# Altium schematic sheet USB HUB.SchDoc
size A3; SheetNumber: 7; SheetTotal: 11
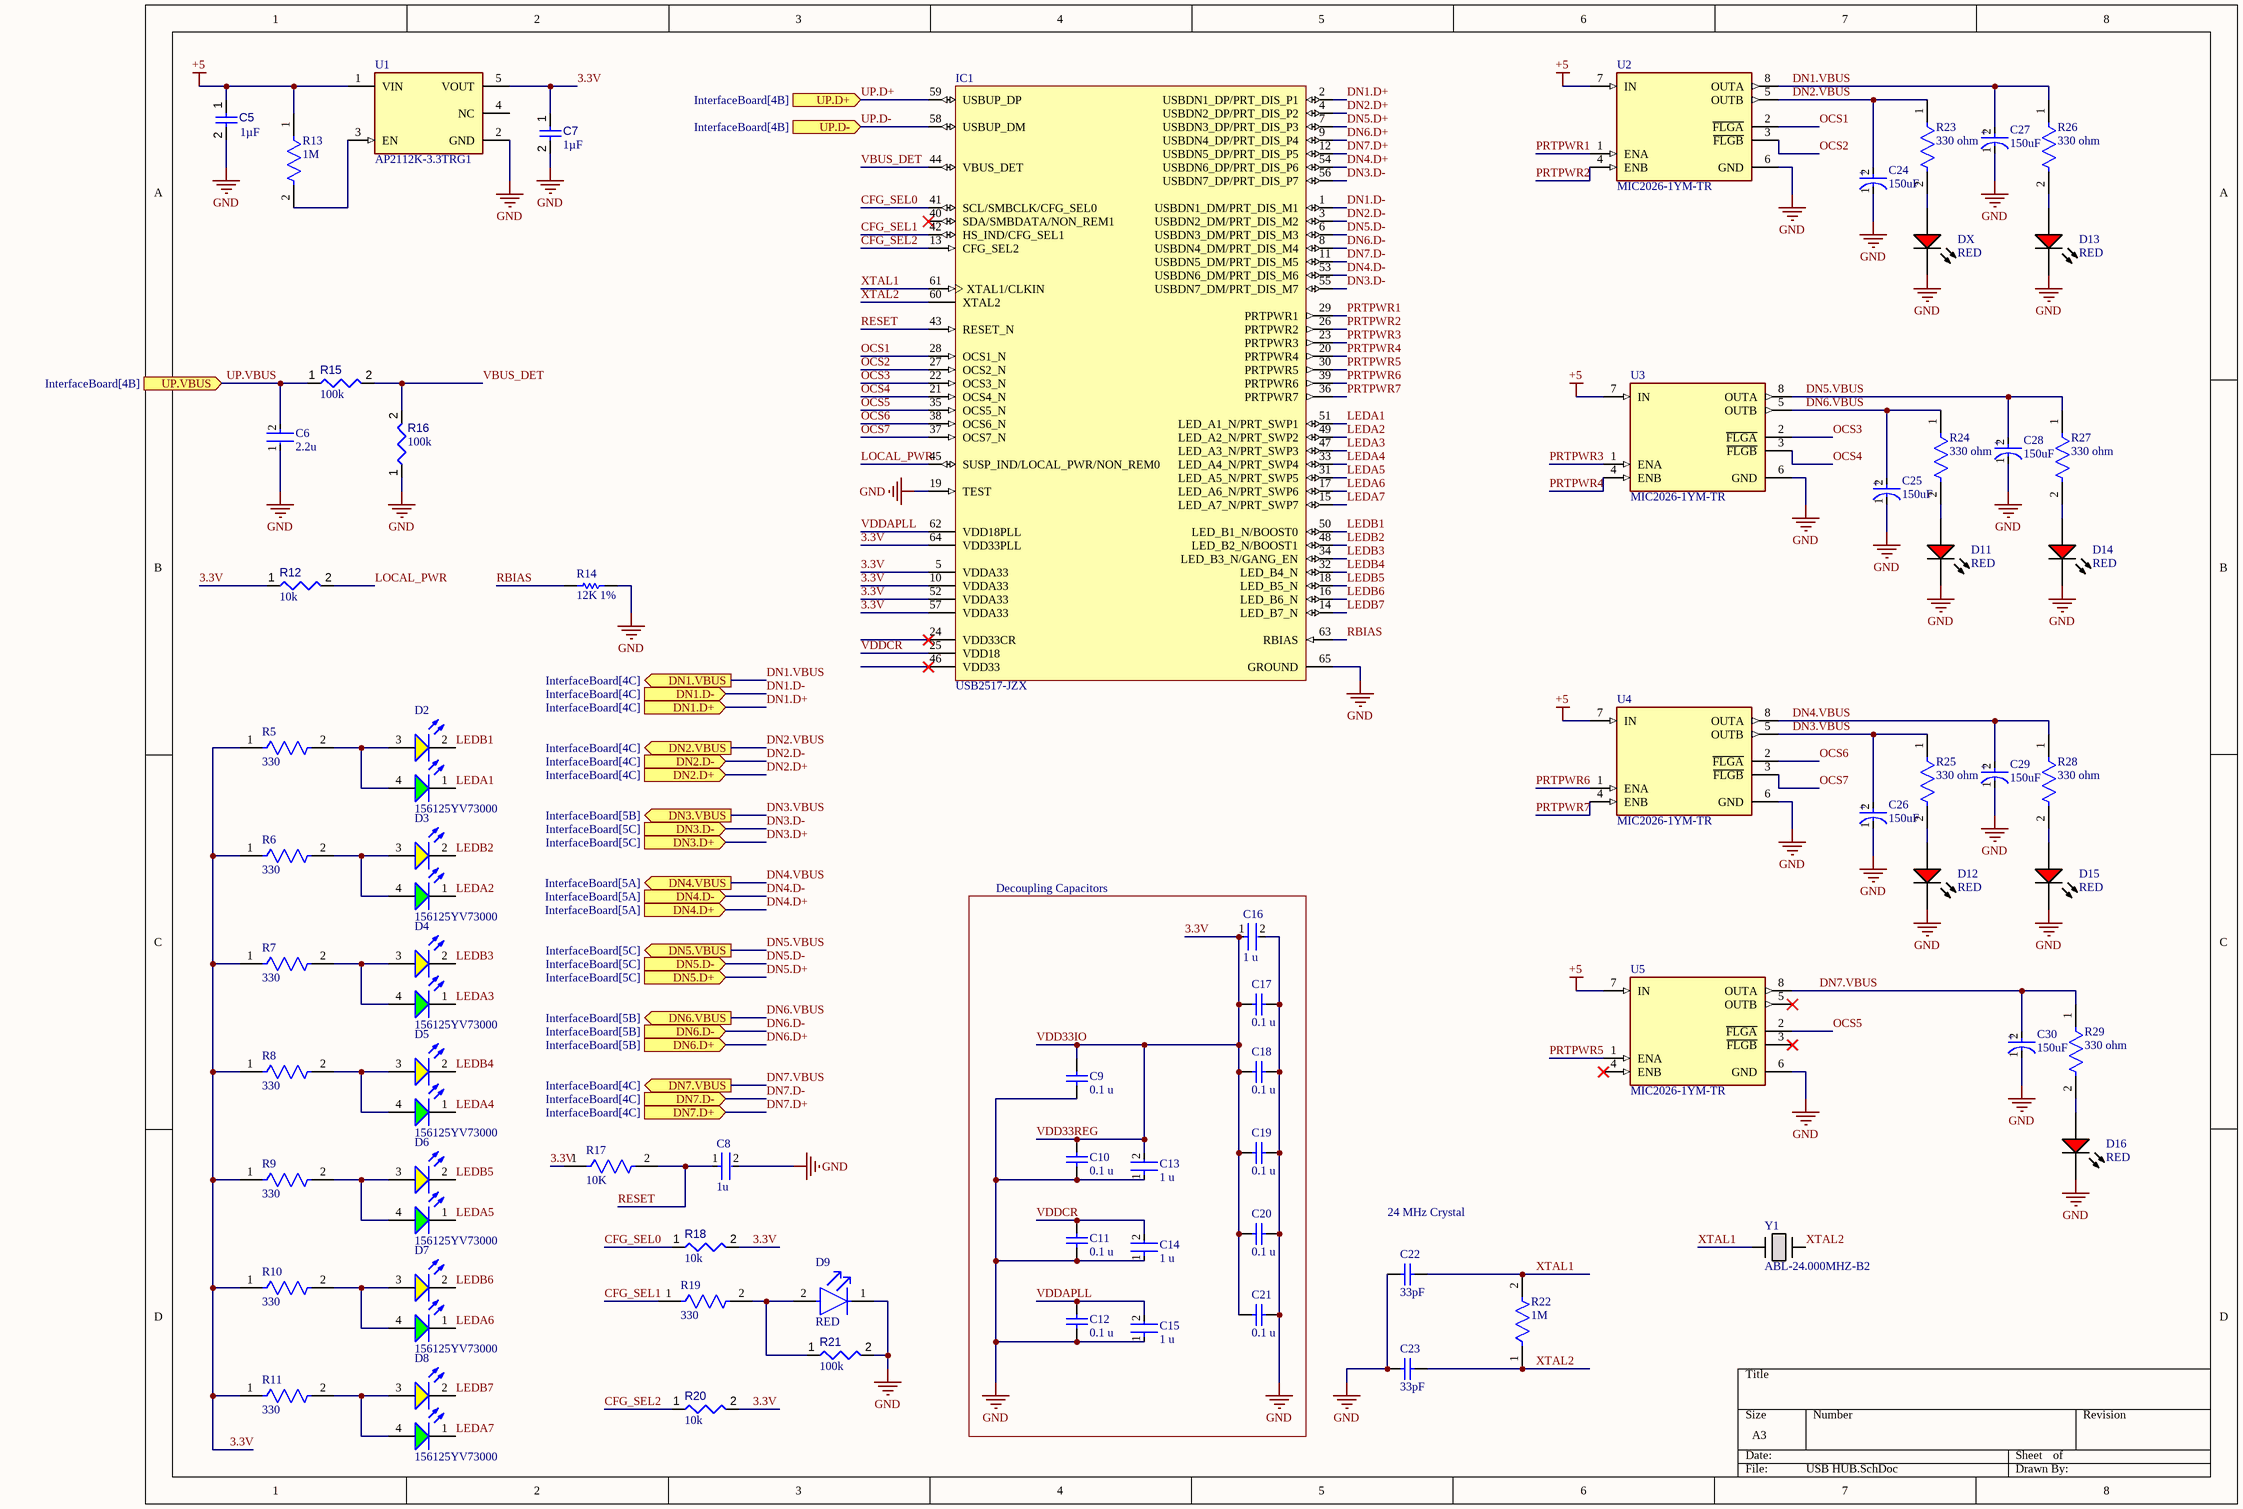
[diagram p0: USB HUB.SchDoc]

## Parts
C5  value 1µF  [CAPC1608X94X35NL15T15]  (hidden comment: Capacitor 1 uF +/- 10% 16 V 0603)
C6  2.2u  [FP-C1608-080-0_1-MFG]
C7  value 1µF  [CAPC1608X94X35NL15T15]  (hidden comment: Capacitor 1 uF +/- 10% 16 V 0603)
C8  1u  [FP-0603-L_1_6_0_15-W_0_81-IPC_A]
C9  0.1 u  [CAPC1608X90X35LL15T15]
C10  0.1 u  [CAPC1608X90X35LL15T15]
C11  0.1 u  [CAPC1608X90X35LL15T15]
C12  0.1 u  [CAPC1608X90X35LL15T15]
C13  1 u  [FP-0603-L_1_6_0_15-W_0_8-IPC_C]
C14  1 u  [FP-0603-L_1_6_0_15-W_0_8-IPC_C]
C15  1 u  [FP-0603-L_1_6_0_15-W_0_8-IPC_C]
C16  1 u  [FP-0603-L_1_6_0_15-W_0_8-IPC_C]
C17  0.1 u  [CAPC1608X90X35LL15T15]
C18  0.1 u  [CAPC1608X90X35LL15T15]
C19  0.1 u  [CAPC1608X90X35LL15T15]
C20  0.1 u  [CAPC1608X90X35LL15T15]
C21  0.1 u  [CAPC1608X90X35LL15T15]
C22  33pF  [WCAP-CSGP_0603_L1.6W0.8H0.8_Reflow]
C23  33pF  [WCAP-CSGP_0603_L1.6W0.8H0.8_Reflow]
C24  150uF  [FP-OS-CON-SMT-B6-MFG]
C25  150uF  [FP-OS-CON-SMT-B6-MFG]
C26  150uF  [FP-OS-CON-SMT-B6-MFG]
C27  150uF  [FP-OS-CON-SMT-B6-MFG]
C28  150uF  [FP-OS-CON-SMT-B6-MFG]
C29  150uF  [FP-OS-CON-SMT-B6-MFG]
C30  150uF  [FP-OS-CON-SMT-B6-MFG]
D2  156125YV73000  [WL-SBRW_1205_reverse mount]
D3  156125YV73000  [WL-SBRW_1205_reverse mount]
D4  156125YV73000  [WL-SBRW_1205_reverse mount]
D5  156125YV73000  [WL-SBRW_1205_reverse mount]
D6  156125YV73000  [WL-SBRW_1205_reverse mount]
D7  156125YV73000  [WL-SBRW_1205_reverse mount]
D8  156125YV73000  [WL-SBRW_1205_reverse mount]
D9  RED  [FP-SML-LX0603SIW-TR-MFG]
D11  RED  [LTST-C191KRKT_V]
D12  RED  [LTST-C191KRKT_V]
D13  RED  [LTST-C191KRKT_V]
D14  RED  [LTST-C191KRKT_V]
D15  RED  [LTST-C191KRKT_V]
D16  RED  [LTST-C191KRKT_V]
DX  RED  [LTST-C191KRKT_V]
IC1  USB2517-JZX  [MCHP-QFN-64-4700X4700TP_L]
R5  330  [FP-CRGCQ0603-IPC_C]
R6  330  [FP-CRGCQ0603-IPC_C]
R7  330  [FP-CRGCQ0603-IPC_C]
R8  330  [FP-CRGCQ0603-IPC_C]
R9  330  [FP-CRGCQ0603-IPC_C]
R10  330  [FP-CRGCQ0603-IPC_C]
R11  330  [FP-CRGCQ0603-IPC_C]
R12  value 10k  [RESC1608X55X25ML10T15]  (hidden comment: Resistor 10k +/-1% 0603 100 mW)
R13  1M  [FP-AC0603-IPC_A]
R14  12K 1%  [RESC1608X55X25LL10T15]
R15  value 100k  [RESC1608X55X25ML10T15]  (hidden comment: Resistor 100k +/-1% 0603 100 mW)
R16  value 100k  [RESC1608X55X25ML10T15]  (hidden comment: Resistor 100k +/-1% 0603 100 mW)
R17  10K  [FP-CRGCQ0603-IPC_C]
R18  value 10k  [RESC1608X55X25ML10T15]  (hidden comment: Resistor 10k +/-1% 0603 100 mW)
R19  330  [FP-CRGCQ0603-IPC_C]
R20  value 10k  [RESC1608X55X25ML10T15]  (hidden comment: Resistor 10k +/-1% 0603 100 mW)
R21  100k  [RESC1608X55X25ML10T15]
R22  1M  [FP-CRGP0603-IPC_C]
R23  330 ohm  [FP-MCT0603-MFG]
R24  330 ohm  [FP-MCT0603-MFG]
R25  330 ohm  [FP-MCT0603-MFG]
R26  330 ohm  [FP-MCT0603-MFG]
R27  330 ohm  [FP-MCT0603-MFG]
R28  330 ohm  [FP-MCT0603-MFG]
R29  330 ohm  [FP-MCT0603-MFG]
U1  AP2112K-3.3TRG1  [FP-SOT25-IPC_A]
U2  MIC2026-1YM-TR  [FP-SOICN-8LD-PL-1-IPC_B]
U3  MIC2026-1YM-TR  [FP-SOICN-8LD-PL-1-IPC_B]
U4  MIC2026-1YM-TR  [FP-SOICN-8LD-PL-1-IPC_B]
U5  MIC2026-1YM-TR  [FP-SOICN-8LD-PL-1-IPC_B]
Y1  ABL-24.000MHZ-B2  [XTAL_HC49P488W46L1150T500H350]

## Blocks framed on the sheet
Decoupling Capacitors: C9-C21

## Ports
DN1.D+ (in, see InterfaceBoard[4C]), DN1.D- (in, see InterfaceBoard[4C]), DN1.VBUS (out, see InterfaceBoard[4C]), DN2.D+ (in, see InterfaceBoard[4C]), DN2.D- (in, see InterfaceBoard[4C]), DN2.VBUS (out, see InterfaceBoard[4C]), DN3.D+ (in, see InterfaceBoard[5C]), DN3.D- (in, see InterfaceBoard[5C]), DN3.VBUS (out, see InterfaceBoard[5B]), DN4.D+ (in, see InterfaceBoard[5A]), DN4.D- (in, see InterfaceBoard[5A]), DN4.VBUS (out, see InterfaceBoard[5A]), DN5.D+ (in, see InterfaceBoard[5C]), DN5.D- (in, see InterfaceBoard[5C]), DN5.VBUS (out, see InterfaceBoard[5C]), DN6.D+ (in, see InterfaceBoard[5B]), DN6.D- (in, see InterfaceBoard[5B]), DN6.VBUS (out, see InterfaceBoard[5B]), DN7.D+ (in, see InterfaceBoard[4C]), DN7.D- (in, see InterfaceBoard[4C]), DN7.VBUS (out, see InterfaceBoard[4C]), UP.D+ (in, see InterfaceBoard[4B]), UP.D- (in, see InterfaceBoard[4B]), UP.VBUS (in, see InterfaceBoard[4B])

## Nets
+5: C5.1 R13.1 U1.1(VIN) U2.7(IN) U3.7(IN) U4.7(IN) U5.7(IN)
GND: C5.2 C6.1 C7.2 C8.2 C9.2 C10.2 C11.2 C12.2 C13.1 C14.1 C15.1 C16.2 C17.1 C18.1 C19.1 C20.1 C21.1 C22.1 C23.1 C24.1(C) C25.1(C) C26.1(C) C27.1(C) C28.1(C) C29.1(C) C30.1(C) D9.1(C) D11.2(K) D12.2(K) D13.2(K) D14.2(K) D15.2(K) D16.2(K) DX.2(K) IC1.19(TEST) IC1.65(GROUND) R14.2 R16.1 R21.2 U1.2(GND) U2.6(GND) U3.6(GND) U4.6(GND) U5.6(GND)
3.3V: C7.1 C9.1 C10.1 C13.2 C16.1 C17.2 C18.2 C19.2 C20.2 C21.2 IC1.5(VDDA33) IC1.10(VDDA33) IC1.52(VDDA33) IC1.57(VDDA33) IC1.64(VDD33PLL) R5.1 R6.1 R7.1 R8.1 R9.1 R10.1 R11.1 R12.1 R17.1 R18.2 R20.2 U1.5(VOUT)  [also labelled VDD33IO, VDD33REG]
CFG_SEL0: IC1.41(SCL/SMBCLK/CFG_SEL0) R18.1
CFG_SEL1: IC1.42(HS_IND/CFG_SEL1) R19.1
CFG_SEL2: IC1.13(CFG_SEL2) R20.1
DN1.D+: IC1.2(USBDN1_DP/PRT_DIS_P1) ; port DN1.D+
DN1.D-: IC1.1(USBDN1_DM/PRT_DIS_M1) ; port DN1.D-
DN1.VBUS: C27.2(A) R26.1 U2.8(OUTA) ; port DN1.VBUS
DN2.D+: IC1.4(USBDN2_DP/PRT_DIS_P2) ; port DN2.D+
DN2.D-: IC1.3(USBDN2_DM/PRT_DIS_M2) ; port DN2.D-
DN2.VBUS: C24.2(A) R23.1 U2.5(OUTB) ; port DN2.VBUS
DN3.D+: port DN3.D+
DN3.D-: IC1.55(USBDN7_DM/PRT_DIS_M7) IC1.56(USBDN7_DP/PRT_DIS_P7) ; port DN3.D-
DN3.VBUS: C26.2(A) R25.1 U4.5(OUTB) ; port DN3.VBUS
DN4.D+: IC1.54(USBDN6_DP/PRT_DIS_P6) ; port DN4.D+
DN4.D-: IC1.53(USBDN6_DM/PRT_DIS_M6) ; port DN4.D-
DN4.VBUS: C29.2(A) R28.1 U4.8(OUTA) ; port DN4.VBUS
DN5.D+: IC1.7(USBDN3_DP/PRT_DIS_P3) ; port DN5.D+
DN5.D-: IC1.6(USBDN3_DM/PRT_DIS_M3) ; port DN5.D-
DN5.VBUS: C28.2(A) R27.1 U3.8(OUTA) ; port DN5.VBUS
DN6.D+: IC1.9(USBDN4_DP/PRT_DIS_P4) ; port DN6.D+
DN6.D-: IC1.8(USBDN4_DM/PRT_DIS_M4) ; port DN6.D-
DN6.VBUS: C25.2(A) R24.1 U3.5(OUTB) ; port DN6.VBUS
DN7.D+: IC1.12(USBDN5_DP/PRT_DIS_P5) ; port DN7.D+
DN7.D-: IC1.11(USBDN5_DM/PRT_DIS_M5) ; port DN7.D-
DN7.VBUS: C30.2(A) R29.1 U5.8(OUTA) ; port DN7.VBUS
LEDA1: D2.1(K) IC1.51(LED_A1_N/PRT_SWP1)
LEDA2: D3.1(K) IC1.49(LED_A2_N/PRT_SWP2)
LEDA3: D4.1(K) IC1.47(LED_A3_N/PRT_SWP3)
LEDA4: D5.1(K) IC1.33(LED_A4_N/PRT_SWP4)
LEDA5: D6.1(K) IC1.31(LED_A5_N/PRT_SWP5)
LEDA6: D7.1(K) IC1.17(LED_A6_N/PRT_SWP6)
LEDA7: D8.1(K) IC1.15(LED_A7_N/PRT_SWP7)
LEDB1: D2.2(K) IC1.50(LED_B1_N/BOOST0)
LEDB2: D3.2(K) IC1.48(LED_B2_N/BOOST1)
LEDB3: D4.2(K) IC1.34(LED_B3_N/GANG_EN)
LEDB4: D5.2(K) IC1.32(LED_B4_N)
LEDB5: D6.2(K) IC1.18(LED_B5_N)
LEDB6: D7.2(K) IC1.16(LED_B6_N)
LEDB7: D8.2(K) IC1.14(LED_B7_N)
LOCAL_PWR: IC1.45(SUSP_IND/LOCAL_PWR/NON_REM0) R12.2
OCS1: IC1.28(OCS1_N) U2.2(~{FLGA})
OCS2: IC1.27(OCS2_N) U2.3(~{FLGB})
OCS3: IC1.22(OCS3_N) U3.2(~{FLGA})
OCS4: IC1.21(OCS4_N) U3.3(~{FLGB})
OCS5: IC1.35(OCS5_N) U5.2(~{FLGA})
OCS6: IC1.38(OCS6_N) U4.2(~{FLGA})
OCS7: IC1.37(OCS7_N) U4.3(~{FLGB})
PRTPWR1: IC1.29(PRTPWR1) U2.1(ENA)
PRTPWR2: IC1.26(PRTPWR2) U2.4(ENB)
PRTPWR3: IC1.23(PRTPWR3) U3.1(ENA)
PRTPWR4: IC1.20(PRTPWR4) U3.4(ENB)
PRTPWR5: IC1.30(PRTPWR5) U5.1(ENA)
PRTPWR6: IC1.39(PRTPWR6) U4.1(ENA)
PRTPWR7: IC1.36(PRTPWR7) U4.4(ENB)
RBIAS: IC1.63(RBIAS) R14.1
RESET: C8.1 IC1.43(RESET_N) R17.2
UP.D+: IC1.59(USBUP_DP) ; port UP.D+
UP.D-: IC1.58(USBUP_DM) ; port UP.D-
UP.VBUS: C6.2 R15.1 ; port UP.VBUS
VBUS_DET: IC1.44(VBUS_DET) R15.2 R16.2
VDDAPLL: C12.1 C15.2 IC1.62(VDD18PLL)
VDDCR: C11.1 C14.2 IC1.25(VDD18)
XTAL1: C22.2 IC1.61(XTAL1/CLKIN) R22.2 Y1.1
XTAL2: C23.2 IC1.60(XTAL2) R22.1 Y1.2
NetD2_3: D2.3(A) D2.4(A) R5.2
NetD3_3: D3.3(A) D3.4(A) R6.2
NetD4_3: D4.3(A) D4.4(A) R7.2
NetD5_3: D5.3(A) D5.4(A) R8.2
NetD6_3: D6.3(A) D6.4(A) R9.2
NetD7_3: D7.3(A) D7.4(A) R10.2
NetD8_3: D8.3(A) D8.4(A) R11.2
NetD9_2: D9.2(A) R19.2 R21.1
NetD11_1: D11.1(A) R24.2
NetD12_1: D12.1(A) R25.2
NetD13_1: D13.1(A) R26.2
NetD14_1: D14.1(A) R27.2
NetD15_1: D15.1(A) R28.2
NetD16_1: D16.1(A) R29.2
NetDX_1: DX.1(A) R23.2
NetR13_2: R13.2 U1.3(EN)

Not connected (* = marked no-connect by the designer): IC1 24(VDD33CR)* 40(SDA/SMBDATA/NON_REM1)* 46(VDD33)*; U1 4(NC); U5 3(~{FLGB})* 4(ENB)* 5(OUTB)*

## Notes on the sheet
- 24 MHz Crystal
- (in symbol CMP-05428-000017-2) +

## Library data of the parts
C5 C7 = CMP-001-00003-6: Chip Capacitor, 1 uF, +/- 10%, 16 V, 0603 (1608 Metric); Voltage Rating: 16V; Capacitor Type: Ceramic; Max Operating Temperature: 125°C; Pins: 2; Tolerance: 10%; Min Operating Temperature: -55°C; RoHS Compliant: True; Mounting Technology: SM; Case/Package: 0603
C6 = CMP-08246-003049-1: Multilayer Ceramic Capacitors 2.2μF ±10% 25V X5R SMD 0603; Capacitance: 2.2uF; Termination: SMD/SMT; Dielectric Material: Ceramic; REACH SVHC: No SVHC; Voltage Rating (DC): 25V; Voltage Rating: 25V; RoHS Compliant: Yes; Case Code (Imperial): 0603; Case/Package: 0603; Height: 0.8mm; Mount: Surface Mount; Min Operating Temperature: -55°C; Tolerance: 10%; Radiation Hardening: No; Dielectric: X5R; Depth: 0.8mm; Package Quantity: 4000; Length: 1.6mm; Weight: 7.1E-05oz; Resistor Type: Ceramic; Series: C; Thickness: 0.035inch; Width: 0.031inch; Case Code (Metric): 1608; Lead Free: Lead Free; Max Operating Temperature: 85°C; Packaging: Tape and Reel
C8 = CMP-2006-04474-2: General Purpose Ceramic Capacitor, 0603, 1uF, 10%, X5R, 15%, 6.3V; Insulation Resistance: 100GR; Dissipation Factor: 5%; Package Quantity: 1; Mount: Surface Mount; Series: -; Number of Pins: 2; Length: 1.6mm; RoHS Compliant: Yes; Capacitance: 1uF; Depth: 0.81mm; Case Code (Imperial): 0603; Lead Free: Lead Free; Max Operating Temperature: 85°C; Case Code (Metric): 1608; Min Operating Temperature: -55°C; Contact Plating: Tin; Voltage: 6.3V; Tolerance: 10%; Width: 0.032inch; Voltage Rating (DC): 6.3V; Voltage Rating: 6.3V; Termination: SMD/SMT; Radiation Hardening: No; Case/Package: 0603; Thickness: 0.035inch; Height: 0.9mm; REACH SVHC: No SVHC; Packaging: Tape and Reel; Construction: Flat; Dielectric: X5R
C9-C12 C17-C21 = CMP-2006-04390-1: 06035C104KAT4A; Manufacturer: AVX Interconnect / Elco; Part Number: 06035C104KAT4A
C13-C16 = CMP-2000-07531-4: Ceramic Capacitor General Use 1uF ±10% 50V X7R 0603 / UMK107AB7105KA-T; Series: M; Width: 0.031inch; Mount: Surface Mount; Radiation Hardening: No; Voltage Rating (DC): 50V; Packaging: Tape and Reel; Termination: SMD/SMT; Depth: 0.8mm; Case Code (Metric): 1608; Case Code (Imperial): 0603; Height: 0.8mm; Voltage Rating: 50V; Package Quantity: 1; Halogen Free: Halogen Free; Dielectric: X7R; Min Operating Temperature: -55°C; Length: 1.6mm; Construction: Flat; Tolerance: 10%; Thickness: 0.037inch; Max Operating Temperature: 125°C; Case/Package: 0603; Capacitance: 1uF; RoHS Compliant: Yes
C22 C23 = CMP-03913-65419545-2: Ceramic Capacitor 33pF, 16VDC, 0603, ±5 %; Voltage Rating: 16V; Tolerance: 5%; Insulation Resistance: 10GΩ; Thickness: 863.6µm; Height: 800µm; Width: 800µm; Case Code (Imperial): 0603; Case Code (Metric): 1608; Case/Package: 0603; Mount: Surface Mount; Min Operating Temperature: -55°C; RoHS: Compliant; Packaging: Cut Tape; Capacitance: 33pF; Max Operating Temperature: 125°C; Length: 1.6mm; Voltage Rating (DC): 16V
C24-C30 = CMP-05428-000017-2: Conductive Polymer Aluminum Solid Capacitors (OS-CON) 150uF ±20% 6.3V; Ripple Current: 3.52A; Leakage Current: 500uA; ESR (Equivalent Series Resistance): 12mR; Polarity: Polar; Dissipation Factor: 12%; Life (Hours): 2000Hour; Number of Pins: 6; Voltage Rating (DC): 6.3V; Lead Free: Lead Free; Height: 5.9mm; Case/Package: Radial; Package Quantity: 1500; Length: 5.9mm; Tolerance: 20%; Voltage: 6.3V; REACH SVHC: No SVHC; Mount: Surface Mount; Min Operating Temperature: -55°C; Ripple Current (AC): 3.52A; Packaging: Tape and Reel; Series: OS-CON™, SVPE; Max Operating Temperature: 105°C; Diameter: 5mm; Voltage Rating: 6.3V; Capacitance: 150uF; RoHS Compliant: Yes; Termination: SMD/SMT; Height - Seated (Max): 0.236inch
D2-D8 = CMP-03913-90235601-1: 156125YV73000 Dual Color LED, Yellow/bright Green, Water Clear, 1.2mm; Forward Voltage: 2V; Luminous Intensity: 50mcd; Viewing Angle: 120°; Forward Current: 40mA; Max Reverse Voltage (DC): 5V; Peak Wavelength: 573nm; Dominant Wavelength: 571nm; NexarPartId: 90235601; Length: 3.2mm; Packaging: Tape and Reel; RoHS: Compliant; Width: 1.2mm; Min Operating Temperature: -40°C; Max Operating Temperature: 85°C; Height: 800µm
D9 = CMP-57192-000009-1: LED RED DIFFUSED SMD; Test Current: 20mA; Forward Voltage: 2V; Approvals: UL; Dominant Wavelength: 636nm; Viewing Angle: 140°; Lens Color: White; Luminous Intensity: 60mcd; Power Rating: 50mW; Number of LEDs: 1; Color: Red; Forward Current: 20mA; Moisture Sensitivity Level: 2; Case Code (Imperial): 0603; Lead Free: Lead Free; Lens Transparency: Diffused; Case Code (Metric): 1608; Height: 0.6mm; Max Operating Temperature: 85°C; Width: 0.8mm; Lens Style: Diffused; Illumination Color: Red; Wavelength: 636nm; REACH SVHC: No SVHC; Package Quantity: 1; RoHS Compliant: Yes; Case/Package: 0603; Number of Pins: 2; Packaging: Tape and Reel; Length: 1.6mm; Mount: Surface Mount; Min Operating Temperature: -25°C
D11-D16 DX = CMP-007-00024-2: LED Uni-Color Red, 62.5 mW, 25 mA, -30 to 85 degC, 2-Pin SMD, RoHS, Tape and Reel; Manufacturer: Lite-On; Power: 75mW; Forward Voltage: 2V; Luminous Intensity: 54mcd; Lens Style: Diffused; Viewing Angle: 130degrees; Forward Current: 20mA; Manufacturer URL: http://www.us.liteon.com/; Case/Package: 0603; Datasheet Version: Rev. F, 05/2013; Package Reference: C191KRKT; Datasheet URL: http://optoelectronics.liteon.com/upload/download/DS-22-99-0151/S_110_LTST-C190KRKT.pdf; Package Description: 2-Pin Surface Mount Device, Body 1.6 x 0.8 mm; Nominal Vf: 2V; Packaging: TapeandReel; RoHS Compliant: True; Pins: 2; Illumination Colour: Red; Colour: Red; Mounting Technology: SM; Package Quantity: 3000; Min Operating Temperature: -55°C; Max Operating Temperature: 85°C
IC1 = CMP-0186-00330-1: USB 2.0 Hi-Speed 7-Port Hub Controller, 3 to 3.6 V, 0 to 70 degC, 64-Pin QFN, RoHS, Tape and Reel; Manufacturer: Microchip; USB Speed: High Speed; MultiTRAK Tech: TRUE; Packing: TRAY; MGMT I/F: I2C; Op Voltage: 3.3 V; Upstream Port: USB 2.0; Voltage Regulator: 1.8 V; Downstream Ports: 7; ComponentLink1URL: http://www.microchip.com/; Mounting Technology: Surface Mount; ROHS: TRUE; ComponentLink3URL: http://ww1.microchip.com/downloads/en/DeviceDoc/2517.pdf; DatasheetVersion: Rev. 2.8; ComponentLink2URL: http://ww1.microchip.com/downloads/en/DeviceDoc/2517.pdf; PackageReference: QFN-64; Operating Temperature: 0 to 70 degC; PackageDescription: 64-Pin Plastic Quad Flat No Lead Package, Body 9 x 9 mm, Pitch 0.5 mm; PartNumber: USB2517-JZX; ComponentLink2Description: Datasheet; ComponentLink3Description: Package Specification; ComponentLink1Description: Manufacturer URL
R5-R11 R19 = CMP-03211-002147-1: CRGCQ 0603 330R 5%; Manufacturer: TE Connectivity; Manufacturer Part Number: CRGCQ0603J330R; Temperature Coefficient: ±100ppm/°C; Power Rating: 0.1W; Value: 330Ω; Voltage Rating: 75V; Tolerance: 0.05; Device Class L1: Passive Components; ComponentLink2URL: https://www.te.com/commerce/DocumentDelivery/DDEController?Action=showdoc&DocId=Data+Sheet%7F1773204-3%7F1%7Fpdf%7FEnglish%7FENG_DS_1773204-3_1.pdf%7F4-2176339-581; ComponentLink2Description: Datasheet; RoHS: TRUE; Category: Res; Digikey Description: CRGCQ 0603 330R 5%; Lead Free: Yes; Octopart: https://octopart.com/crgcq0603j330r-te+connectivity-91018118; Mouser Description: Res General Purpose Thick Film 0603 330 Ohm 5% 1/10W ±100ppm/°C Molded Paper T/R; Height: 0.55mm; Composition: Thick Film; Series: CRGCQ; Package: CRGCQ0603; Device Class L3: Chip SMD Resistors; Resistance: 330Ω; Ambient Temperature Range High: +70°C; Temperature: -55°C to +155°C; Device Class L2: Resistors; Ipc Land Pattern Name: RESC16080X45; Temperature Range High: +155°C; Temperature Range Low: -55°C
R12 R18 R20 = CMP-009-00017-5: Chip Resistor, 10 KOhm, +/- 1%, 01 W, -55 to 155 degC, 0603 (1608 Metric); Voltage Rating: 50V; Power: 100mW; RoHS Compliant: True; Min Operating Temperature: -55°C; Pins: 2; Case/Package: 0603; Mounting Technology: SM; Max Operating Temperature: 155°C; Tolerance: 1%
R13 = CMP-03412-038630-1: RES 1MΩ 1.00% 0.1W 0603; Resistance: 1MR; Tolerance: 1%; Case/Package: 0603; RoHS Compliant: Yes
R14 = CMP-2000-04198-1: Manufacturer: Yageo; Part Number: RC0603FR-1312KL
R15 R16 R21 = CMP-009-00023-5: Chip Resistor, 100 KOhm, +/- 1%, 0.1 W, -55 to 155 degC, 0603 (1608 Metric); Voltage Rating: 50V; Power: 100mW; Max Operating Temperature: 155°C; RoHS Compliant: True; Tolerance: 1%; Pins: 2; Case/Package: 0603; Mounting Technology: SM; Min Operating Temperature: -55°C
  R21: Value: 100k
R17 = CMP-03211-009884-1: CRGCQ 0603 10K 5%; Manufacturer Part Number: CRGCQ0603J10K; Manufacturer: TE Connectivity; Tolerance: 0.05; Power Rating: 0.1W; Resistance: 10KΩ; Voltage Rating: 75V; Value: 10KΩ; Temperature Coefficient: ±100ppm/°C; Composition: Thick Film; ComponentLink2URL: https://www.te.com/commerce/DocumentDelivery/DDEController?Action=showdoc&DocId=Data+Sheet%7F1773204-3%7F1%7Fpdf%7FEnglish%7FENG_DS_1773204-3_1.pdf%7F4-2176339-923; Device Class L1: Passive Components; Package: CRGCQ0603; Mouser Description: Res Thick Film 0603 10K Ohm 5% 0.1W(1/10W) ±100ppm/C Pad SMD Automotive T/R; Temperature Range High: +155°C; Category: Res; Device Class L2: Resistors; Height: 0.55mm; RoHS: TRUE; Lead Free: Yes; Ipc Land Pattern Name: RESC16080X45; Temperature: -55°C to +155°C; Series: CRGCQ; Digikey Description: CRGCQ 0603 10K 5%; Octopart: https://octopart.com/crgcq0603j10k-te+connectivity-91018097; Device Class L3: Chip SMD Resistors; Ambient Temperature Range High: +70°C; ComponentLink2Description: Datasheet; Temperature Range Low: -55°C
R22 = CMP-03211-004384-3: RES 1M OHM 1% 1/4W 0603; Resistance: 1MR; Max Power Dissipation: 250mW; Temperature Coefficient: 100ppm/°C; Case Code (Imperial): 0603; Min Operating Temperature: -55°C; Max Operating Temperature: 155°C; RoHS Compliant: Yes; Packaging: Cut Tape; Case/Package: 0603; Tolerance: 1%; Resistor Type: Thick Film; Case Code (Metric): 1608; Number of Terminations: 2
R23-R29 = CMP-02407-004102-1: RES SMD 100 OHM 1% 1/8W 0603; Temperature Coefficient: 25ppm/°C; Power Rating: 100mW; Resistance: 330R; Tolerance: 0.5%; Military Standard: Not; Case/Package: 0603; Height: 0.45mm; Max Operating Temperature: 125°C; Radiation Hardening: No; Composition: Thin Film; Mount: Surface Mount; Packaging: Tape and Reel; Length: 1.55mm; Depth: 0.85mm; Min Operating Temperature: -55°C; Lead Free: Lead Free; Contact Plating: Tin
U1 = CMP-12756-000035-1: IC REG LINEAR 3.3V 600MA SOT25; Number of Regulators: 1; Output Type: Fixed; Polarity: Positive; Min Input Voltage: 2.5V; Max Input Voltage: 6V; Accuracy: 1.5%; Quiescent Current: 55uA; Dropout Voltage: 250mV; Min Operating Temperature: -40°C; Length: 3.1mm; Output Current: 600mA; Max Operating Temperature: 85°C; Package Quantity: 1; Output Voltage: 3.3V; Width: 1.7mm; Number of Outputs: 1; Packaging: Tape and Reel; Height: 1.3mm; Lead Free: Lead Free; Max Output Current: 600mA; Case/Package: SOT-23-5; Mount: Surface Mount; Number of Pins: 5
U2-U5 = CMP-06317-000004-1: IC PWR SWITCH N-CHAN 1:2 8SOIC; On-State Resistance: 90mR; Fault Protection: Over Temperature; Interface: On/Off; Max Output Current: 500mA; Number of Outputs: 2; Output Configuration: High Side; Max Operating Temperature: 85°C; Case/Package: SOIC; Packaging: Cut Tape; Lead Free: Lead Free; REACH SVHC: No SVHC; Min Operating Temperature: -40°C; Number of Pins: 8
Y1 = ABL-24.000MHZ-B2: No Description Available; Manufacturer_Name: Abracon; Copyright: Copyright (C) 2025 Ultra Librarian. All rights reserved.; Manufacturer_Part_Number: ABL-24.000MHZ-B2